# EAGLE design Rotator (EAGLE 7.3.0)
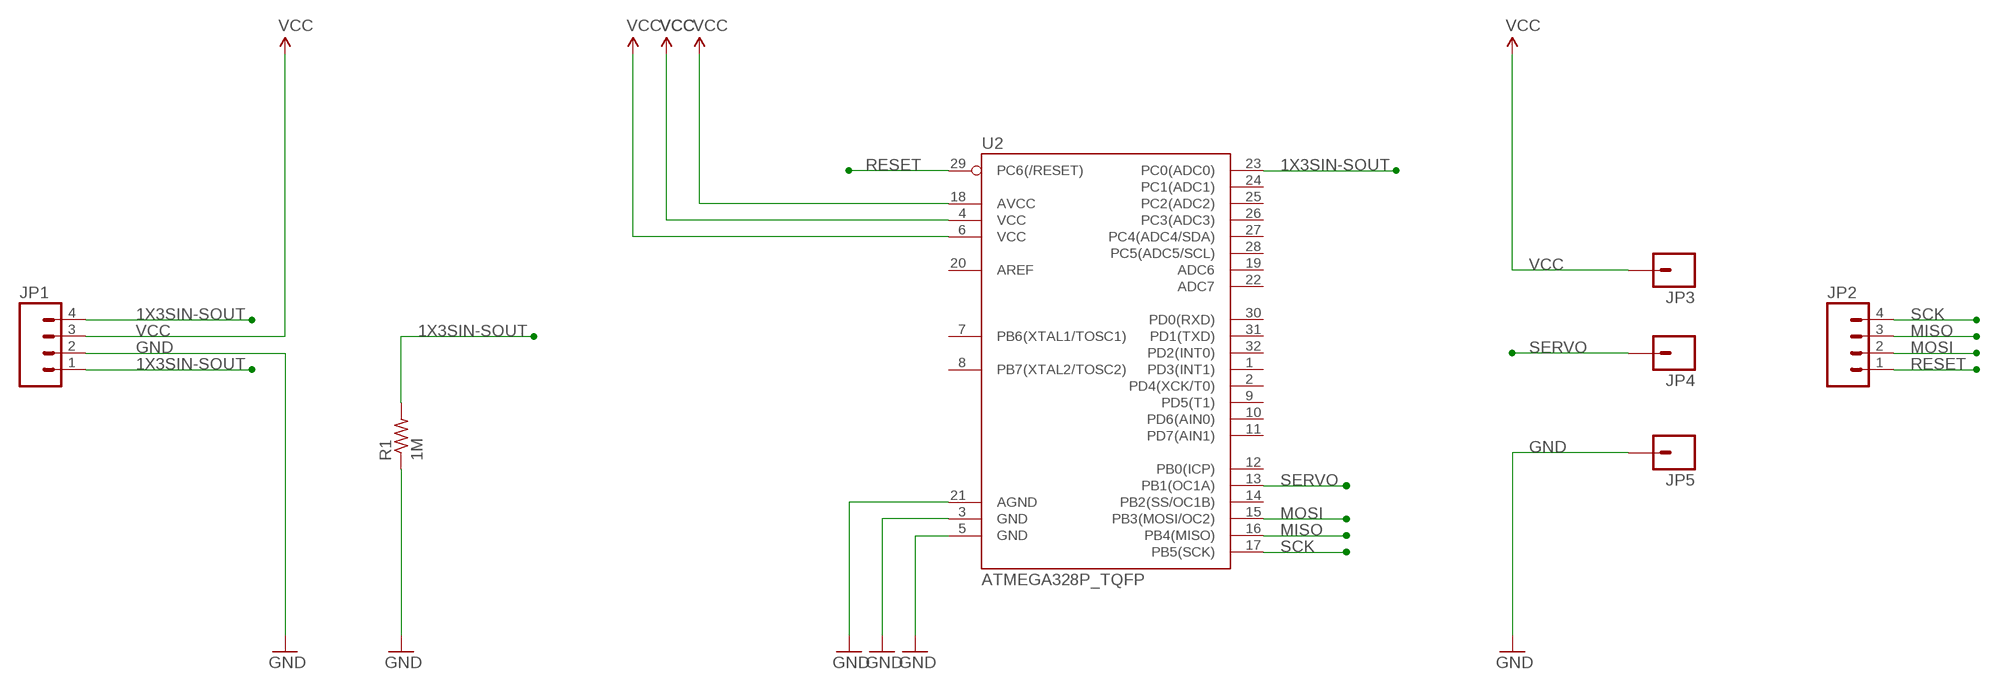
[diagram p0: schematic, sheet 1]

## Parts
JP1  M04PTH  [1X04]
JP2  M04PTH  [1X04]
JP3  M01PTH  [1X01]
JP4  M01PTH  [1X01]
JP5  M01PTH  [1X01]
R1  1M  R-US_R0603  [R0603]
U2  ATMEGA328P_TQFP  [TQFP32-08]

## Nets
1X3SIN-SOUT: JP1.1 JP1.4 R1.2 U2.23(PC0(ADC0))
GND: JP1.2 JP5.1 R1.1 U2.3(GND) U2.5(GND) U2.21(AGND)
MISO: JP2.3 U2.16(PB4(MISO))
MOSI: JP2.2 U2.15(PB3(MOSI/OC2))
RESET: JP2.1 U2.29(PC6(/RESET))
SCK: JP2.4 U2.17(PB5(SCK))
SERVO: JP4.1 U2.13(PB1(OC1A))
VCC: JP1.3 JP3.1 U2.4(VCC) U2.6(VCC) U2.18(AVCC)
Unconnected: U2.1(PD3(INT1)) U2.2(PD4(XCK/T0)) U2.7(PB6(XTAL1/TOSC1)) U2.8(PB7(XTAL2/TOSC2)) U2.9(PD5(T1)) U2.10(PD6(AIN0)) U2.11(PD7(AIN1)) U2.12(PB0(ICP)) U2.14(PB2(SS/OC1B)) U2.19(ADC6) U2.20(AREF) U2.22(ADC7) U2.24(PC1(ADC1)) U2.25(PC2(ADC2)) U2.26(PC3(ADC3)) U2.27(PC4(ADC4/SDA)) U2.28(PC5(ADC5/SCL)) U2.30(PD0(RXD)) U2.31(PD1(TXD)) U2.32(PD2(INT0))

## Library data of the parts
JP1 JP2 = SparkFun-Connectors:M04: Header 4 Standard 4-pin 0.1" header. Use with straight break away headers (SKU : PRT-00116), right angle break away headers (PRT-00553), swiss pins (PRT-00743), machine pins (PRT-00117), and female headers (PRT-00115). Molex polarized connector foot print use with SKU : PRT-08231 with associated crimp pins and housings. 1MM SMD Version SKU: PRT-10208
JP3-JP5 = SparkFun-Connectors:M01: Header 1 Standard 1-pin 0.1" header. Use with straight break away headers (SKU : PRT-00116), right angle break away headers (PRT-00553), swiss pins (PRT-00743), machine pins (PRT-00117), and female headers (PRT-00115).
R1 = adafruit:R-US_: RESISTOR, American symbol
U2 = SparkFun-DigitalIC:ATMEGA328P_TQFP; PROD_ID: IC-09069

## Board
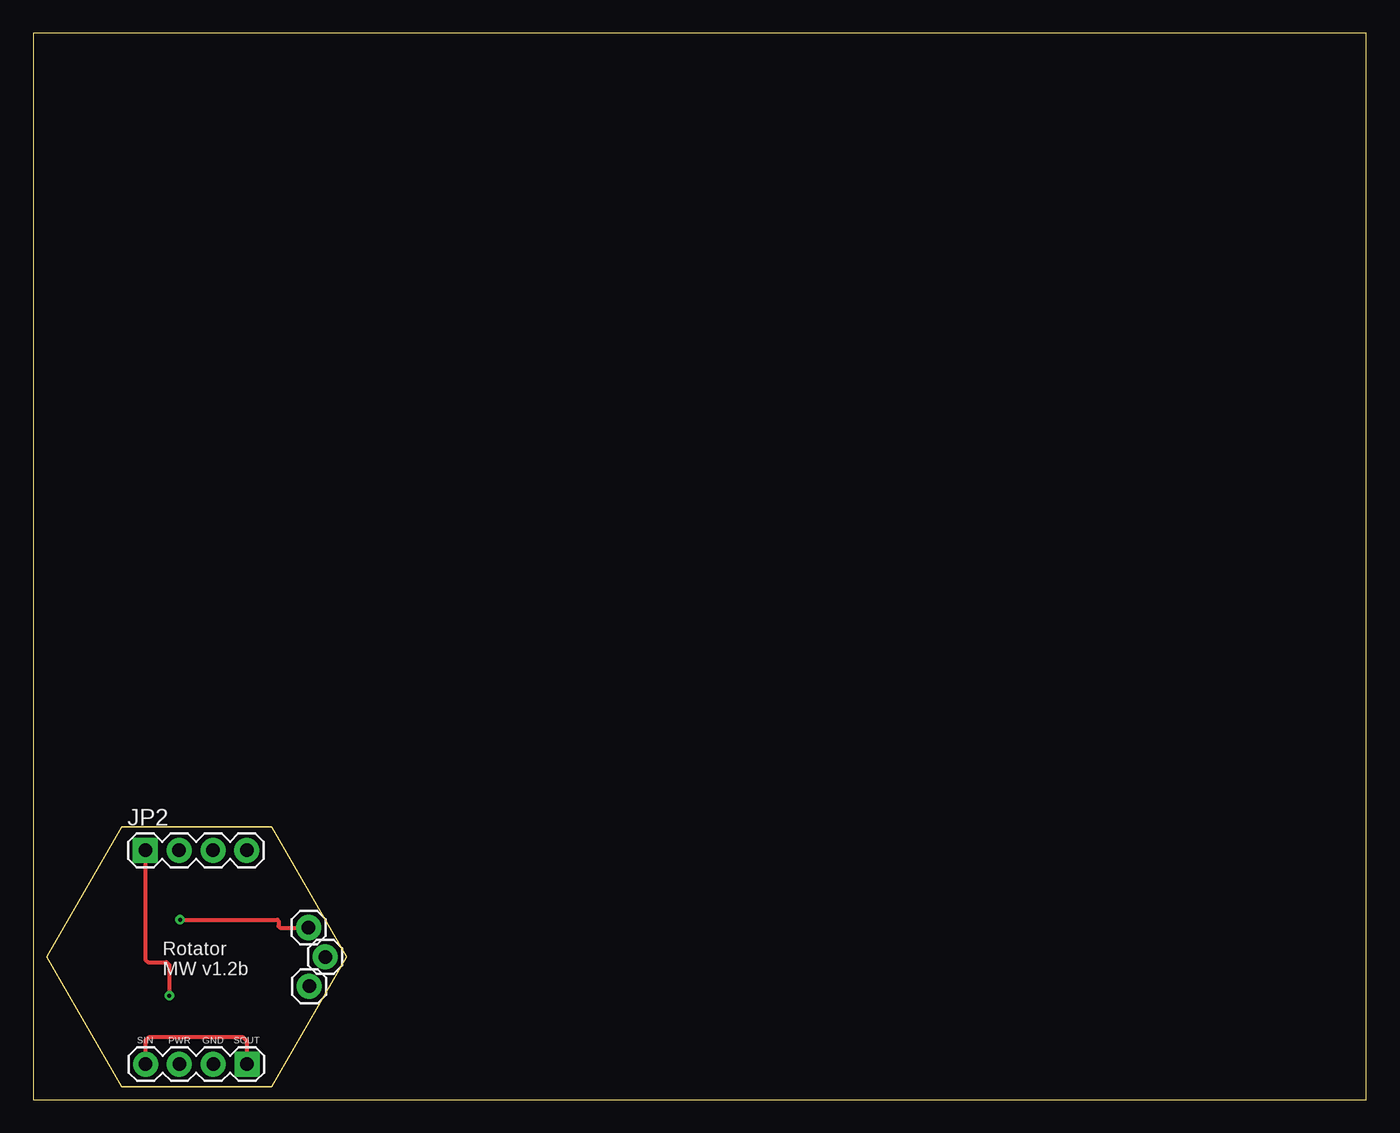
[diagram p1: board, top side]
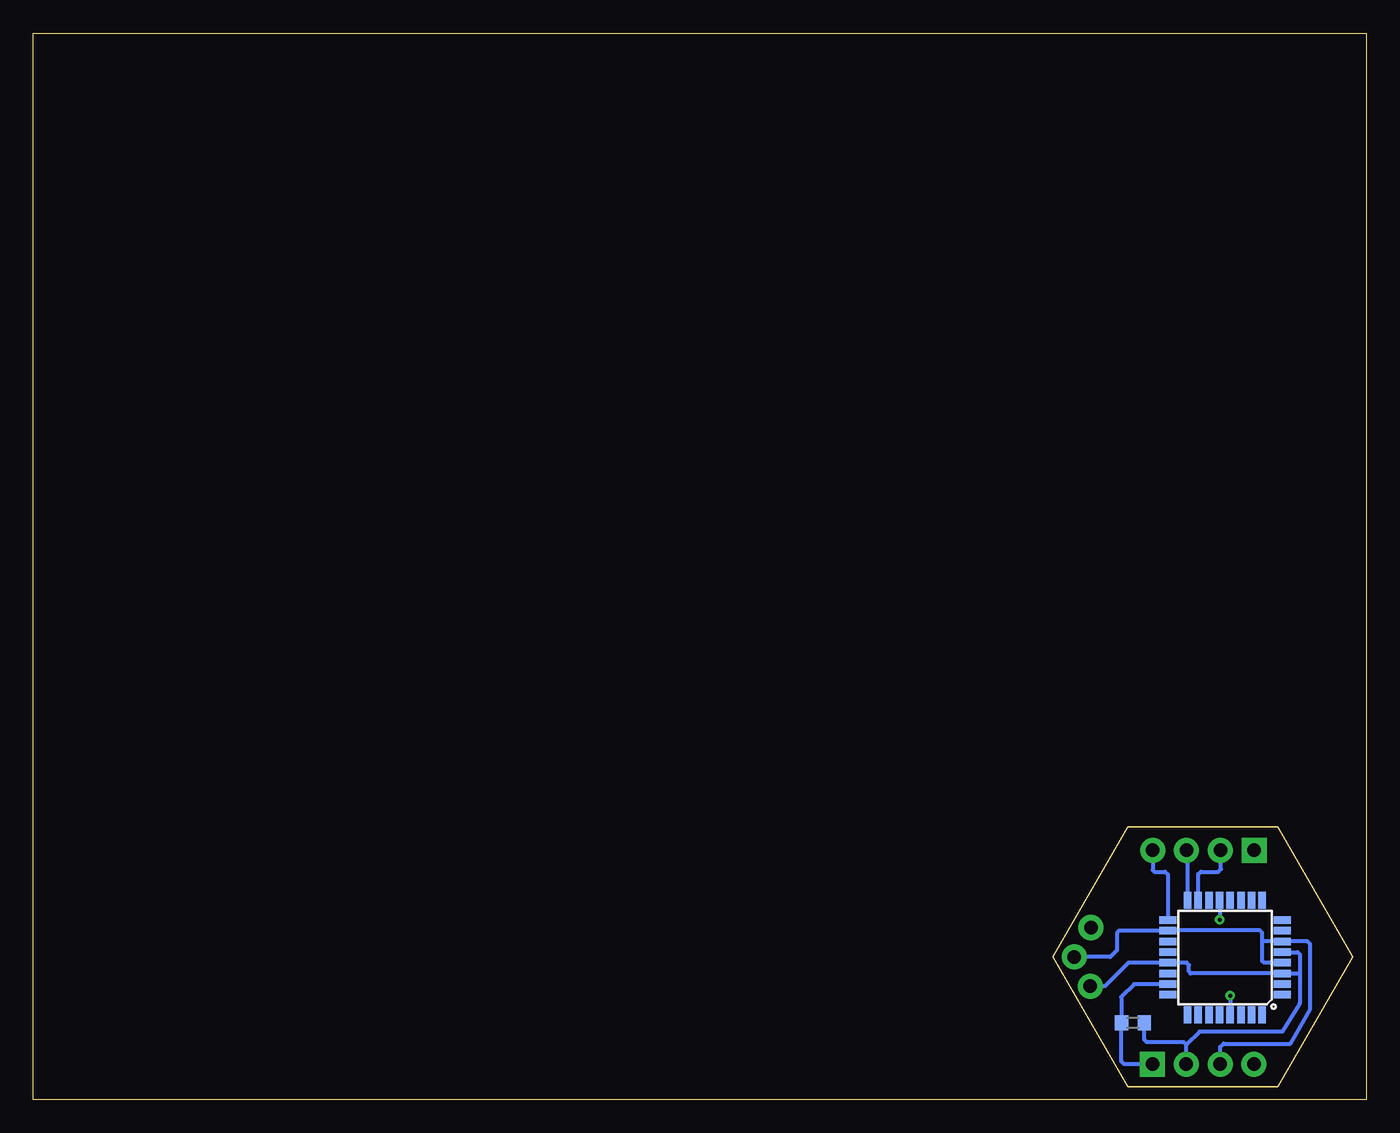
[diagram p2: board, bottom side, seen from below]

Size 100 x 80 mm. Coordinates in mm from the lower left corner, seen from the top.
Outline: 0,0 100,0 100,80 0,80 0,0
Outline: 23.49,10.7 17.86,0.96 6.61,0.96 0.99,10.7 6.61,20.44 17.86,20.44 23.49,10.7
Copper layers (1*16): Top 0.035mm / dielectric 1.5mm / Bottom 0.035mm
Design rules "default *": minimum track width 10mil, minimum drill 24mil, track to track 8mil, track to pad 8mil, pad to pad 8mil, via to via 8mil, smd to smd 8mil, copper to edge 0mil, drill to drill 8mil, minimum pad ring 10mil, minimum via ring 8mil, stop-mask expansion 4mil, vias tented up to drill 0mil, thermal gap 10mil

### Footprints (pad centres in the part's own frame; a part is rotated, then mirrored left to right if it is on the bottom)
1X04 = drill 1.016 pad 1.88 square: 1 0,0 | drill 1.016 pad 1.88: 2 2.54,0; 3 5.08,0; 4 7.62,0
1X01 = drill 1.016 pad 1.88: 1 0,0
R0603 = smd 1 x 1.1: 1 -0.85,0; 2 0.85,0
TQFP32-08 = smd 1.27 x 0.559: 1 -4.293,2.8; 2 -4.293,2; 3 -4.293,1.2; 4 -4.293,0.4; 5 -4.293,-0.4; 6 -4.293,-1.2; 7 -4.293,-2; 8 -4.293,-2.8; 17 4.293,-2.8; 18 4.293,-2; 19 4.293,-1.2; 20 4.293,-0.4; 21 4.293,0.4; 22 4.293,1.2; 23 4.293,2; 24 4.293,2.8 | smd 0.559 x 1.27: 9 -2.8,-4.293; 10 -2,-4.293; 11 -1.2,-4.293; 12 -0.4,-4.293; 13 0.4,-4.293; 14 1.2,-4.293; 15 2,-4.293; 16 2.8,-4.293; 25 2.8,4.293; 26 2,4.293; 27 1.2,4.293; 28 0.4,4.293; 29 -0.4,4.293; 30 -1.2,4.293; 31 -2,4.293; 32 -2.8,4.293

### Placement (x,y rotation side)
JP1  16.04,2.66 180 top
JP2  8.4,18.7 0 top
JP3  21.9,10.7 0 top
JP4  20.65,12.9 0 top
JP5  20.7,8.5 0 top
R1  17.5,5.76 180 bottom
U2  10.6,10.66 180 bottom

### Tracks (layer width: path | path; a pad name or v marks a point on that pad's centre or on a via)
1X3SIN-SOUT
  Top 0.305: JP1.4 8.42,4.42 8.7,4.7 15.7,4.7 16.01,4.39 16.01,2.69 JP1.1
  Bottom 0.305: JP1.1 18.16,2.66 18.37,2.87 18.37,5.74 R1.2 18.37,5.78 18.37,7.7 17.41,8.66 U2.23
GND
  Bottom 0.305: JP1.2 13.5,4.1 | 13.5,4.1 13.7,4.3 16.46,4.3 16.66,4.5 R1.1 | JP5.1 19.6,8.5 17.84,10.26 U2.21 13.48,10.26 13.3,10.08 13.3,9.6 13.16,9.46 U2.3 5.06,9.46 5,9.4 | U2.5 5.16,11.06 5,10.9 5,9.4 | 5,9.4 5,7.2 6.3,5.1 12.5,5.1 13.5,4.1
MISO
  Bottom 0.305: U2.16 13.4,18.62 JP2.3
MOSI
  Bottom 0.305: U2.15 12.6,16.9 12.4,17.1 11.1,17.1 10.9,17.3 10.9,18.66 JP2.2
RESET  (via drill 0.3 pad 0.25)
  Top 0.305: JP2.1 8.4,10.5 8.6,10.3 10,10.3 10.2,10.1 v10.2,7.8
  Bottom 0.305: v10.2,7.8 U2.29
SCK
  Bottom 0.305: JP2.4 16.02,17.22 15.9,17.1 15.1,17.1 14.9,16.9 U2.17
SERVO  (via drill 0.3 pad 0.25)
  Top 0.305: v11,13.5 18.3,13.5 18.4,13.4 18.4,13 18.5,12.9 JP4.1
  Bottom 0.305: U2.13 v11,13.5
VCC
  Bottom 0.305: JP3.1 19.2,10.7 18.7,11.2 18.7,12.5 18.54,12.66 U2.18 14.85,12.7 8,12.7 7.8,12.5 7.8,11.9 | U2.4 7.66,10.26 7.8,10.4 7.8,11.9 | 7.8,11.9 7.76,11.86 U2.6 6.3,11.87 4.42,11.87 4.2,11.65 4.2,6.8 5.7,4.2 10.7,4.2 10.96,3.94 JP1.3

### Text on the board
tPlace: Rotator / MW v1.2b | SIN | PWR | GND | SOUT